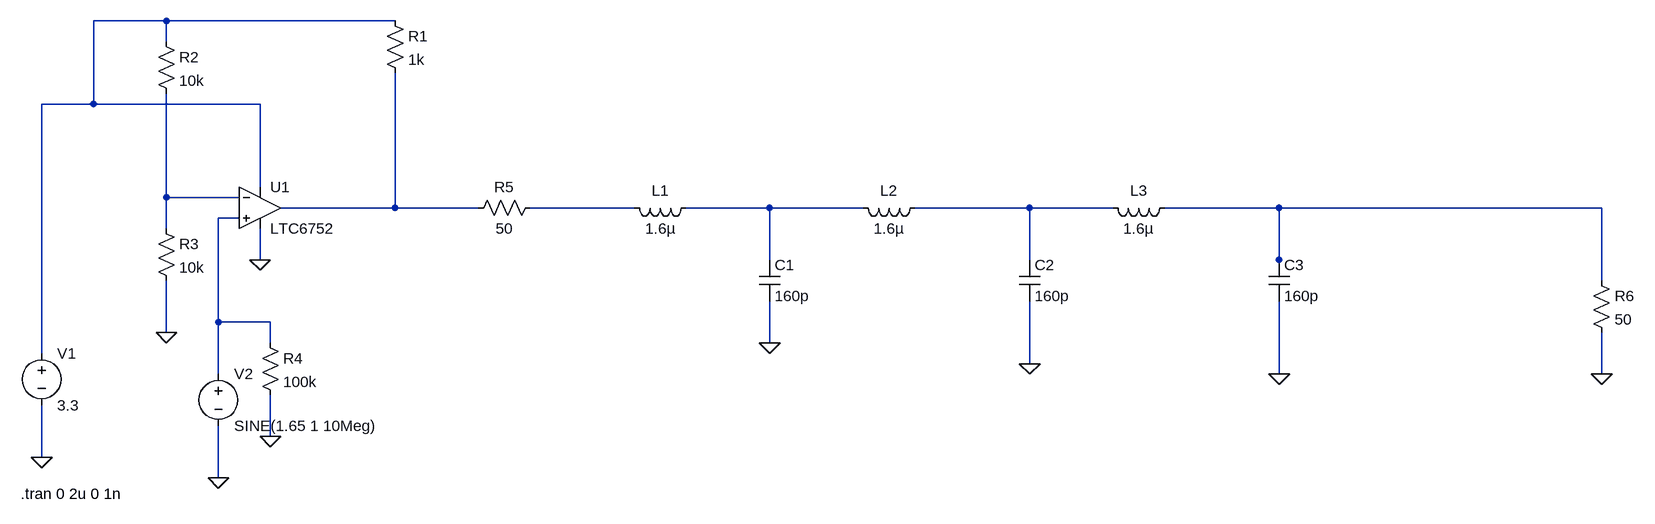
[diagram p0: schematic Squarewave.asc]
Squarewave.asc, the LTspice schematic file:
Version 4.1
SHEET 1 2104 680
WIRE -160 -240 -272 -240
WIRE 192 -240 -160 -240
WIRE -160 -208 -160 -240
WIRE -272 -112 -272 -240
WIRE -272 -112 -352 -112
WIRE -16 -112 -272 -112
WIRE -16 16 -16 -112
WIRE -160 32 -160 -128
WIRE -48 32 -160 32
WIRE 192 48 192 -160
WIRE 192 48 16 48
WIRE 320 48 192 48
WIRE 560 48 400 48
WIRE 768 48 640 48
WIRE 912 48 768 48
WIRE 1168 48 992 48
WIRE 1296 48 1168 48
WIRE 1552 48 1376 48
WIRE 2048 48 1552 48
WIRE -48 64 -80 64
WIRE -160 80 -160 32
WIRE -16 128 -16 80
WIRE 768 128 768 48
WIRE 1168 128 1168 48
WIRE 1552 128 1552 48
WIRE 1552 144 1552 128
WIRE 2048 160 2048 48
WIRE -80 224 -80 64
WIRE 0 224 -80 224
WIRE -160 240 -160 160
WIRE 0 256 0 224
WIRE 768 256 768 192
WIRE -352 272 -352 -112
WIRE 1168 288 1168 192
WIRE -80 304 -80 224
WIRE 1552 304 1552 192
WIRE 2048 304 2048 240
WIRE 0 400 0 336
WIRE -352 432 -352 352
WIRE -80 464 -80 384
FLAG -352 432 0
FLAG -160 240 0
FLAG 0 400 0
FLAG -80 464 0
FLAG -16 128 0
FLAG 768 256 0
FLAG 1168 288 0
FLAG 1552 304 0
FLAG 2048 304 0
SYMBOL Comparators\\LTC6752 -16 -16 R0
SYMATTR InstName U1
SYMBOL voltage -352 256 R0
WINDOW 123 0 0 Left 0
WINDOW 39 0 0 Left 0
SYMATTR InstName V1
SYMATTR Value 3.3
SYMBOL res 176 -256 R0
SYMATTR InstName R1
SYMATTR Value 1k
SYMBOL res -176 -224 R0
SYMATTR InstName R2
SYMATTR Value 10k
SYMBOL res -176 64 R0
SYMATTR InstName R3
SYMATTR Value 10k
SYMBOL res -16 240 R0
SYMATTR InstName R4
SYMATTR Value 100k
SYMBOL voltage -80 288 R0
WINDOW 123 0 0 Left 0
WINDOW 39 0 0 Left 0
SYMATTR InstName V2
SYMATTR Value SINE(1.65 1 10Meg)
SYMBOL res 416 32 R90
WINDOW 0 0 56 VBottom 2
WINDOW 3 32 56 VTop 2
SYMATTR InstName R5
SYMATTR Value 50
SYMBOL ind 656 32 R90
WINDOW 0 5 56 VBottom 2
WINDOW 3 32 56 VTop 2
SYMATTR InstName L1
SYMATTR Value 1.6µ
SYMBOL cap 752 128 R0
SYMATTR InstName C1
SYMATTR Value 160p
SYMBOL ind 1008 32 R90
WINDOW 0 5 56 VBottom 2
WINDOW 3 32 56 VTop 2
SYMATTR InstName L2
SYMATTR Value 1.6µ
SYMBOL cap 1152 128 R0
SYMATTR InstName C2
SYMATTR Value 160p
SYMBOL res 2032 144 R0
SYMATTR InstName R6
SYMATTR Value 50
SYMBOL ind 1392 32 R90
WINDOW 0 5 56 VBottom 2
WINDOW 3 32 56 VTop 2
SYMATTR InstName L3
SYMATTR Value 1.6µ
SYMBOL cap 1536 128 R0
SYMATTR InstName C3
SYMATTR Value 160p
TEXT -384 488 Left 2 !.tran 0 2u 0 1n

The netlist it stands for:
* Squarewave.asc
X§U1 N008 N002 N001 0 N003 LTC6752  ; pins In+ In- V+ V- OUT
V1 N001 0 3.3
R1 N001 N003 1k
R2 N001 N002 10k
R3 N002 0 10k
R4 N008 0 100k
V2 N008 0 SINE(1.65 1 10Meg)
R5 N004 N003 50
L1 N005 N004 1.6µ
C1 N005 0 160p
L2 N006 N005 1.6µ
C2 N006 0 160p
R6 N007 0 50
L3 N007 N006 1.6µ
C3 N007 0 160p
.tran 0 2u 0 1n
.lib LTC7.lib
.backanno
.end